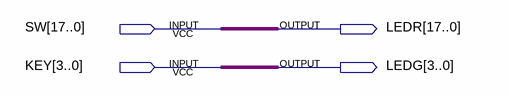
[diagram p0: schematic sheet]
// Quartus schematic LSP.bdf as structural Verilog: 0 symbols, 4 pins
module LSP (
  input  [17:0] SW,
  input  [3:0] KEY,
  output [17:0] LEDR,
  output [3:0] LEDG
);


  assign LEDG = KEY;
  assign LEDR = SW;
endmodule
